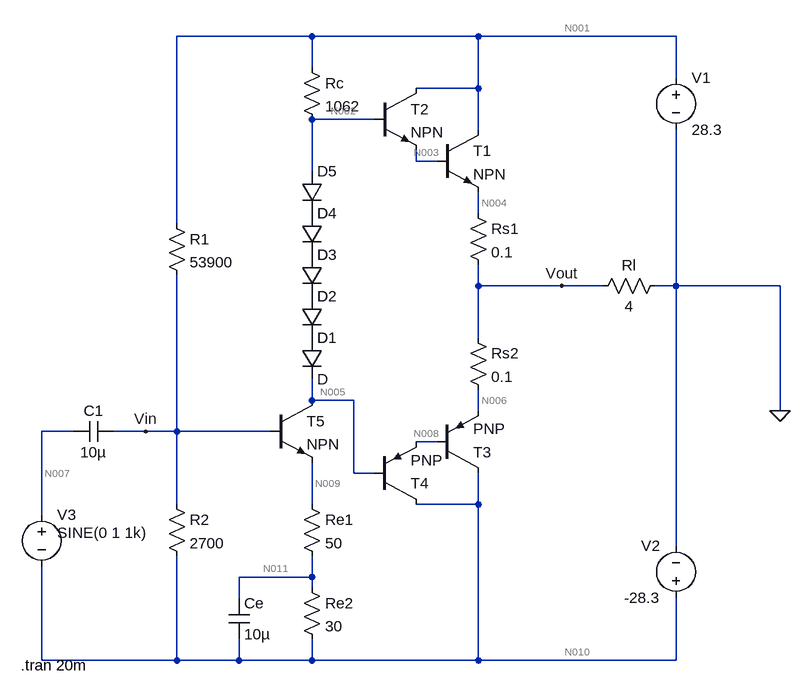
[diagram p0: schematic Power Amplifier Circuit with Ideal Values.asc]
Power Amplifier Circuit with Ideal Values.asc, the LTspice schematic file:
Version 4
SHEET 1 1020 680
WIRE 208 -560 0 -560
WIRE 464 -560 208 -560
WIRE 768 -560 464 -560
WIRE 208 -512 208 -560
WIRE 768 -496 768 -560
WIRE 464 -480 464 -560
WIRE 464 -480 368 -480
WIRE 304 -432 208 -432
WIRE 464 -416 464 -480
WIRE 368 -368 368 -384
WIRE 400 -368 368 -368
WIRE 208 -352 208 -432
WIRE 464 -288 464 -320
WIRE 0 -272 0 -560
WIRE 464 -176 464 -208
WIRE 592 -176 464 -176
WIRE 656 -176 592 -176
WIRE 768 -176 768 -416
WIRE 768 -176 736 -176
WIRE 928 -176 768 -176
WIRE 464 -96 464 -176
WIRE 208 0 208 -32
WIRE 272 0 208 0
WIRE 464 16 464 -16
WIRE 928 16 928 -176
WIRE -160 48 -208 48
WIRE -48 48 -96 48
WIRE 0 48 0 -192
WIRE 0 48 -48 48
WIRE 144 48 0 48
WIRE 400 64 368 64
WIRE 272 112 272 0
WIRE 304 112 272 112
WIRE 0 160 0 48
WIRE 208 160 208 96
WIRE 464 160 464 112
WIRE 464 160 368 160
WIRE -208 176 -208 48
WIRE 768 224 768 -176
WIRE 208 272 208 240
WIRE 208 272 96 272
WIRE 208 288 208 272
WIRE 96 304 96 272
WIRE -208 400 -208 256
WIRE 0 400 0 240
WIRE 0 400 -208 400
WIRE 96 400 96 368
WIRE 96 400 0 400
WIRE 208 400 208 368
WIRE 208 400 96 400
WIRE 464 400 464 160
WIRE 464 400 208 400
WIRE 768 400 768 304
WIRE 768 400 464 400
FLAG -48 48 Vin
FLAG 592 -176 Vout
FLAG 928 16 0
SYMBOL res 192 144 R0
SYMATTR InstName Re1
SYMATTR Value 50
SYMBOL res 192 272 R0
SYMATTR InstName Re2
SYMATTR Value 30
SYMBOL npn 144 0 R0
SYMATTR InstName T5
SYMBOL diode 192 -96 R0
SYMATTR InstName D1
SYMBOL diode 192 -160 R0
SYMATTR InstName D2
SYMBOL diode 192 -224 R0
SYMATTR InstName D3
SYMBOL diode 192 -288 R0
SYMATTR InstName D4
SYMBOL diode 192 -352 R0
SYMATTR InstName D5
SYMBOL res 192 -528 R0
SYMATTR InstName Rc
SYMATTR Value 1062
SYMBOL npn 400 -416 R0
SYMATTR InstName T1
SYMBOL res 448 -304 R0
SYMATTR InstName Rs1
SYMATTR Value 0.1
SYMBOL res 448 -112 R0
SYMATTR InstName Rs2
SYMATTR Value 0.1
SYMBOL res 752 -192 R90
WINDOW 0 0 56 VBottom 2
WINDOW 3 32 56 VTop 2
SYMATTR InstName Rl
SYMATTR Value 4
SYMBOL pnp 400 112 M180
SYMATTR InstName T3
SYMBOL cap 80 304 R0
SYMATTR InstName Ce
SYMATTR Value 10µ
SYMBOL res -16 -288 R0
SYMATTR InstName R1
SYMATTR Value 53900
SYMBOL res -16 144 R0
SYMATTR InstName R2
SYMATTR Value 2700
SYMBOL voltage 768 -512 R0
WINDOW 123 0 0 Left 0
WINDOW 39 0 0 Left 0
SYMATTR InstName V1
SYMATTR Value 28.3
SYMBOL voltage 768 320 R180
WINDOW 0 24 96 Left 2
WINDOW 3 24 16 Left 2
WINDOW 123 0 0 Left 0
WINDOW 39 0 0 Left 0
SYMATTR InstName V2
SYMATTR Value -28.3
SYMBOL voltage -208 160 R0
WINDOW 3 24 44 Left 2
WINDOW 123 0 0 Left 0
WINDOW 39 0 0 Left 0
SYMATTR Value SINE(0 1 1k)
SYMATTR InstName V3
SYMBOL npn 304 -480 R0
SYMATTR InstName T2
SYMBOL pnp 304 160 M180
SYMATTR InstName T4
SYMBOL cap -96 32 R90
WINDOW 0 0 32 VBottom 2
WINDOW 3 32 32 VTop 2
SYMATTR InstName C1
SYMATTR Value 10µ
TEXT -240 408 Left 2 !.tran 20m

The netlist it stands for:
* Power Amplifier Circuit with Ideal Values.asc
Re1 N009 N011 50
Re2 N011 N010 30
Q§T5 N005 Vin N009 0 NPN
D1 P001 N005 D
D2 P002 P001 D
D3 P003 P002 D
D4 P004 P003 D
D5 N002 P004 D
Rc N001 N002 1062
Q§T1 N001 N003 N004 0 NPN
Rs1 N004 Vout 0.1
Rs2 Vout N006 0.1
Rl 0 Vout 4
Q§T3 N010 N008 N006 0 PNP
Ce N011 N010 10µ
R1 N001 Vin 53900
R2 Vin N010 2700
V1 N001 0 28.3
V2 N010 0 -28.3
V3 N007 N010 SINE(0 1 1k)
Q§T2 N001 N002 N003 0 NPN
Q§T4 N010 N005 N008 0 PNP
C1 Vin N007 10µ
.model D D
.lib standard.dio
.model NPN NPN
.model PNP PNP
.lib standard.bjt
.tran 20m
.backanno
.end

* Results of the author's LTspice run, read from the files saved beside the schematic
* Operating Point, zero values left out:
*   V(n009) = -26.9 V
*   V(n011) = -27.77 V
*   V(n010) = -28.3 V
*   V(n005) = 5.992 V
*   V(vin) = -26.05 V
*   V(p001) = 6.721 V
*   V(p002) = 7.45 V
*   V(p003) = 8.179 V
*   V(p004) = 8.908 V
*   V(n002) = 9.637 V
*   V(n001) = 28.3 V
*   V(n003) = 8.786 V
*   V(n004) = 7.816 V
*   V(vout) = 7.621 V
*   V(n006) = 7.617 V
*   V(n008) = 6.745 V
*   V(n007) = -28.3 V
*   Ic(T4) = -436.7 µA
*   Ib(T4) = -4.367 µA
*   Ie(T4) = 441.1 µA
*   Ic(T3) = -44.11 mA
*   Ib(T3) = -441.1 µA
*   Ie(T3) = 44.55 mA
*   Ic(T2) = 19.11 mA
*   Ib(T2) = 191.1 µA
*   Ie(T2) = -19.31 mA
*   Ic(T1) = 1.931 A
*   Ib(T1) = 19.31 mA
*   Ie(T1) = -1.95 A
*   Ic(T5) = 17.39 mA
*   Ib(T5) = 173.9 µA
*   Ie(T5) = -17.56 mA
*   I(D5) = 17.38 mA
*   I(D4) = 17.38 mA
*   I(D3) = 17.38 mA
*   I(D2) = 17.38 mA
*   I(D1) = 17.38 mA
*   I(R2) = 834.4 µA
*   I(R1) = 1.008 mA
*   I(Rl) = -1.905 A
*   I(Rs2) = 44.55 mA
*   I(Rs1) = 1.95 A
*   I(Rc) = 17.57 mA
*   I(Re2) = 17.56 mA
*   I(Re1) = 17.56 mA
*   I(V2) = 62.94 mA
*   I(V1) = -1.968 A
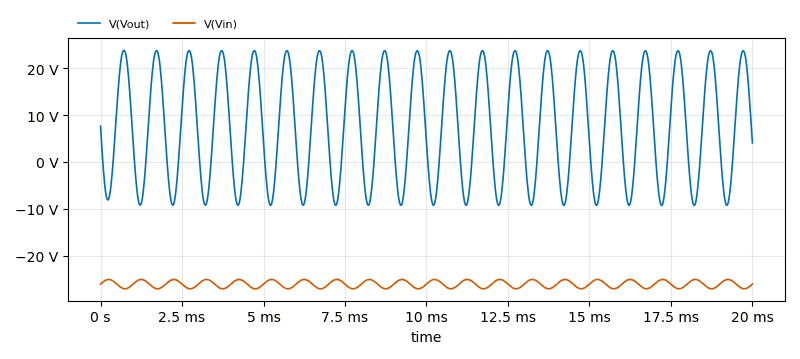
[diagram p1: Transient Analysis of Power Amplifier Circuit with Ideal Values.asc, plotted from the saved traces]
* Transient Analysis, 1 run:
*   V(Vout): min -9.26 V, max 23.8 V, average 7.568 V, rms 13.95 V, last 4.077 V
*   V(Vin): min -27.05 V, max -25.05 V, average -26.05 V, rms 26.06 V, last -26.04 V